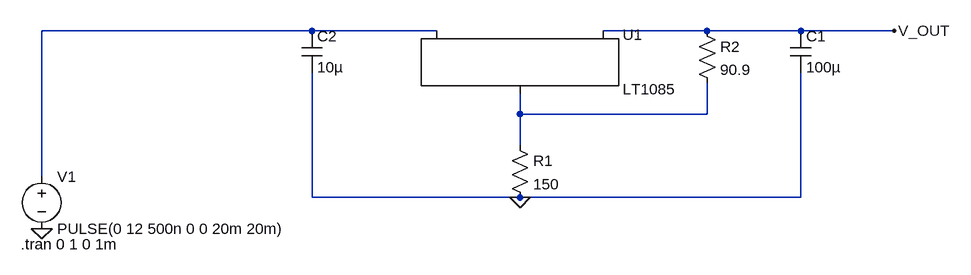
[diagram p0: schematic LT1085_5_V_Power_Supply_Schematic.asc]
LT1085_5_V_Power_Supply_Schematic.asc, the LTspice schematic file:
Version 4
SHEET 1 880 680
WIRE -128 -112 -544 -112
WIRE 64 -112 -128 -112
WIRE 480 -112 320 -112
WIRE 624 -112 480 -112
WIRE 768 -112 624 -112
WIRE 192 16 192 -16
WIRE 480 16 480 -32
WIRE 480 16 192 16
WIRE 192 64 192 16
WIRE -544 112 -544 -112
WIRE -128 144 -128 -48
WIRE 192 144 -128 144
WIRE 624 144 624 -48
WIRE 624 144 192 144
FLAG 192 144 0
FLAG 768 -112 V_OUT
FLAG -544 192 0
SYMBOL PowerProducts\\LT1085 192 -112 R0
SYMATTR InstName U1
SYMBOL voltage -544 96 R0
WINDOW 123 0 0 Left 0
WINDOW 39 0 0 Left 0
SYMATTR InstName V1
SYMATTR Value PULSE(0 12 500n 0 0 20m 20m)
SYMBOL res 176 48 R0
SYMATTR InstName R1
SYMATTR Value 150
SYMBOL res 464 -128 R0
SYMATTR InstName R2
SYMATTR Value 90.9
SYMBOL cap 608 -112 R0
SYMATTR InstName C1
SYMATTR Value 100µ
SYMBOL cap -144 -112 R0
SYMATTR InstName C2
SYMATTR Value 10µ
TEXT -576 216 Left 2 !.tran 0 1 0 1m

The netlist it stands for:
* LT1085_5_V_Power_Supply_Schematic.asc
XU1 N002 V_OUT N001 LT1085
V1 N001 0 PULSE(0 12 500n 0 0 20m 20m)
R1 N002 0 150
R2 V_OUT N002 90.9
C1 V_OUT 0 100µ
C2 N001 0 10µ
.tran 0 1 0 1m
.backanno
.end